# Altium schematic sheet [09] - TK2560_MotorDriver.SchDoc
size A4; SheetNumber: 10; SheetTotal: 15
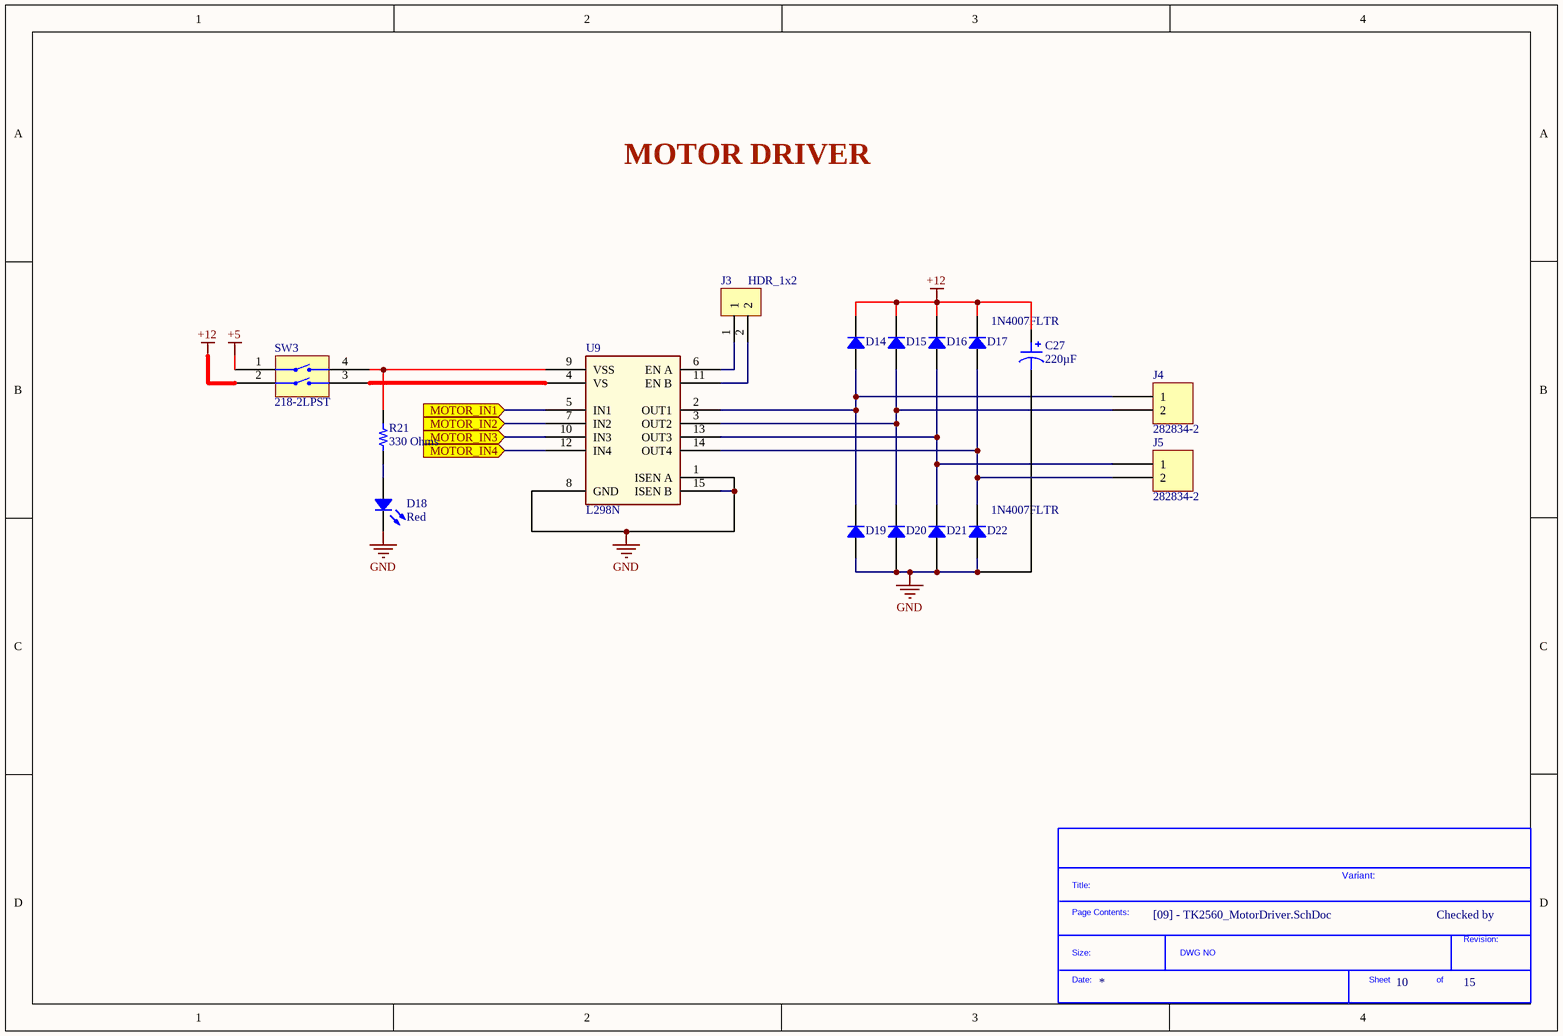
[diagram p0: [09] - TK2560_MotorDriver.SchDoc]

## Parts
*?  SDTitleBlock  (value not drawn)  (graphical)
C27  220µF  [CAP ALSMD 8.3MM H10.5MM]
D14  1N4007FLTR  [SOD123F]  (value not drawn)
D15  1N4007FLTR  [SOD123F]  (value not drawn)
D16  1N4007FLTR  [SOD123F]  (value not drawn)
D17  1N4007FLTR  [SOD123F]
D18  Red  [LED 1206_3216 RED]
D19  1N4007FLTR  [SOD123F]  (value not drawn)
D20  1N4007FLTR  [SOD123F]  (value not drawn)
D21  1N4007FLTR  [SOD123F]  (value not drawn)
D22  1N4007FLTR  [SOD123F]
J3  HDR_1x2  [HDR_1x2]
J4  282834-2  [TE 282834-2]
J5  282834-2  [TE 282834-2]
R21  330 Ohms  [RES 0805_2012]
SW3  218-2LPST  [CTS 218-2LPJ]
U9  L298N  [Multiwatt15]

## Ports
MOTOR_IN1 (in), MOTOR_IN2 (in), MOTOR_IN3 (in), MOTOR_IN4 (in)

## Nets
+5: SW3.1(GND)
+12: C27.1 D14.2 D15.2 D16.2 D17.2 SW3.2(GND)
GND: C27.2 D18.2 D19.1 D20.1 D21.1 D22.1 U9.1(ISEN_A) U9.8(GND) U9.15(ISEN_B)
MOTOR_IN1: U9.5(IN1) ; port MOTOR_IN1
MOTOR_IN2: U9.7(IN2) ; port MOTOR_IN2
MOTOR_IN3: U9.10(IN3) ; port MOTOR_IN3
MOTOR_IN4: U9.12(IN4) ; port MOTOR_IN4
NetD14_1: D14.1 D19.2 J4.1 U9.2(OUT1)
NetD15_1: D15.1 D20.2 J4.2 U9.3(OUT2)
NetD16_1: D16.1 D21.2 J5.1 U9.13(OUT3)
NetD17_1: D17.1 D22.2 J5.2 U9.14(OUT4)
NetD18_1: D18.1 R21.1
NetJ3_1: J3.1 U9.6(EN_A)
NetJ3_2: J3.2 U9.11(EN_B)
NetR21_2: R21.2 SW3.4(GND) U9.9(VSS)
NetSW3_3: SW3.3(GND) U9.4(VS)

## Notes on the sheet
- MOTOR DRIVER
- Variant:
- Checked by
- (in symbol SDTitleBlock) Title:; Page Contents:; Revision:; Size:; DWG NO; Date:; Sheet; of

## Library data of the parts
C27 = EEE-FK1V221GP: CAP ALUM 220UF 20% 35V SMD; Manufacturer: Panasonic Electronic Components; Impedance: 160 mOhms; Lifetime @ Temp.: 5000 Hrs @ 105°C; Polarization: Polar; Ripple Current @ High Frequency: 600mA @ 100kHz; Ripple Current @ Low Frequency: 450mA @ 120Hz; Surface Mount Land Size: 0.327" L x 0.327" W (8.30mm x 8.30mm); Part Number: EEE-FK1V221GP; Applications: Automotive; Capacitance: 220µF; ComponentLink1Description: Datasheet; ComponentLink1URL: http://industrial.panasonic.com/www-cgi/jvcr13pz.cgi?E+PZ+4+ABA0120+EEEFK1V221GP+8+WW; ComponentLink2Description: DigiKey Link; ComponentLink2URL: http://digikey.com/product-detail/en/panasonic-electronic-components/EEE-FK1V221GP/PCE4321CT-ND/1014320; Device Package: Radial, Can - SMD; Height - Seated (Max): 0.413" (10.50mm); LastUpdated: 9/2/2020 01:25:16; Lifecycle Status: Active; Minimum Order: 1; Mounting Type: Surface Mount; Operating Temperature: -55°C ~ 105°C; Package / Case: Radial, Can - SMD; Packaging: TapeAndReel; PartId: 7494; Part Status: Active; Price: 0.33; Ratings: AEC-Q200; Series: FK; Size / Dimension: 0.315" Dia (8.00mm); Supplier 1: DigiKey; Supplier Part Number 1: PCE4321CT-ND; Tolerance: ±20%; Value: 220µF; Voltage - Rated: 35V
D14-D17 D19-D22 = 1N4007FLTR: STANDARD RECTIFIER 1000V SOD-123; Manufacturer: SMC Diode Solutions; Capacitance @ Vr, F: 15pF @ 4V, 1MHz; Current - Average Rectified (Io): 1A; Current - Reverse Leakage @ Vr: 5µA @ 1000V; Speed: Standard Recovery >500ns, > 200mA (Io); Voltage - Forward (Vf) (Max) @ If: 1.1V @ 1A; Part Number: 1N4007FLTR; ComponentLink1Description: Datasheet; ComponentLink1URL: http://www.smc-diodes.com/propdf/1N4001FL-1N4007FL%20N1646%20REV.A.pdf; ComponentLink2Description: DigiKey Link; ComponentLink2URL: http://digikey.com/product-detail/en/smc-diode-solutions/1N4007FLTR/1655-1N4007FLCT-ND/11657827; Diode Type: Standard; LastUpdated: 8/30/2020 20:59:55; Lifecycle Status: Active; Minimum Order: 1; Mounting Type: Surface Mount; Package / Case: SOD-123F; Packaging: TapeAndReel; PartId: 3314; Price: 0.01; Supplier 1: DigiKey; Supplier Part Number 1: 1655-1N4007FLCT-ND; Supplier Device Package: SOD-123FL; Voltage - DC Reverse (Vr) (Max): 1000V
D18 = APTL3216SURCK-01: LED SMD; Manufacturer: Kingbright; Configuration: 1206; Current - Test: 20mA; Lens Color: Colorless; Lens Size: 1.10mm Dia; Lens Style: Round with Domed Top; Lens Transparency: Clear; Millicandela Rating: 230mcd; Viewing Angle: 80°; Voltage - Forward (Vf) (Typ): 1.95V; Wavelength - Dominant: 630nm; Wavelength - Peak: 645nm; Part Number: APTL3216SURCK-01; Color: Red; ComponentLink1Description: Datasheet; ComponentLink1URL: http://www.kingbrightusa.com/images/catalog/SPEC/APTL3216SURCK-01.pdf; ComponentLink2Description: DigiKey Link; ComponentLink2URL: http://digikey.com/product-detail/en/kingbright/APTL3216SURCK-01/754-APTL3216SURCK-01CT-ND/10293135; Device Package: 1206 (3216 Metric); Height (Max): 1.20mm; LastUpdated: 9/2/2020 01:21:09; Lifecycle Status: Active; Minimum Order: 1; Mounting Type: Surface Mount; Package / Case: 1206 (3216 Metric); Packaging: TapeAndReel; PartId: 229; Part Status: Active; Price: 0.08; Series: Heli-R; Size / Dimension: 3.20mm L x 1.60mm W; Supplier 1: DigiKey; Supplier Part Number 1: 754-APTL3216SURCK-01CT-ND; Supplier Device Package: 1206; Value: Red
J3 = HDR_1x2: Pin Header 2.54MM Pitch Str, 1X2PIN, Full G/f, NY6T, 6.1MM*2.5MM*3.0MM / Bag; Manufacturer: Amphenol; Manufacturer Part Number: G800W306018EU; Supplier 1: Mouser; Stock 1: 1088; Pricing 1: 1=0.10000, 10=0.02700, 50=0.02700, 100=0.02600, 1000=0.02200, 10000=0.01900 (USD); RoHS Compliant: Yes; Supplier Part Number 1: 523-G800W306018EU
J4 J5 = 282834-2: TERM BLK 2P SIDE ENT 2.54MM PCB; Manufacturer: TE Connectivity AMP Connectors; Current: 10A; Mating Orientation: Horizontal with Board; Number of Levels: 1; Pitch: 0.100" (2.54mm); Positions Per Level: 2; Voltage: 150V; Wire Gauge: 16-30 AWG; Wire Termination: Screw - Rising Cage Clamp; Part Number: 282834-2; Color: Green; ComponentLink1Description: Datasheet; ComponentLink1URL: https://www.te.com/commerce/DocumentDelivery/DDEController?Action=srchrtrv&DocNm=282834&DocType=Customer+Drawing&DocLang=English; ComponentLink2Description: DigiKey Link; ComponentLink2URL: http://digikey.com/product-detail/en/te-connectivity-amp-connectors/282834-2/A98333-ND/1150135; LastUpdated: 1/15/2020 04:15:38; Lifecycle Status: Active; Minimum Order: 1; Mounting Type: Through Hole; Packaging: Bulk; Part Status: Active; Price: 0.88; Series: Buchanan; Supplier 1: DigiKey; Supplier Part Number 1: A98333-ND
R21 = ERJ-6GEYJ331V: RES SMD 330 OHM 5% 1/8W 0805; Manufacturer: Panasonic Electronic Components; Power (Watts): 0.125W, 1/8W; Temperature Coefficient: ±200ppm/°C; Part Number: ERJ-6GEYJ331V; Value: 330 Ohms; ComponentLink1Description: Datasheet; ComponentLink1URL: http://industrial.panasonic.com/www-cgi/jvcr13pz.cgi?E+PZ+3+AOA0001+ERJ6GEYJ331V+7+WW; ComponentLink2Description: DigiKey Link; ComponentLink2URL: http://digikey.com/product-detail/en/panasonic-electronic-components/ERJ-6GEYJ331V/P330ACT-ND/90025; Composition: Thick Film; Device Package: 0805 (2012 Metric); Features: Automotive AEC-Q200; Height - Seated (Max): 0.028" (0.70mm); LastUpdated: 02/09/2020 01:15:19; Lifecycle Status: Active; Minimum Order: 1; Number of Terminations: 2; Operating Temperature: -55°C ~ 155°C; Package / Case: 0805 (2012 Metric); Packaging: TapeAndReel; PartId: 30017; Part Status: Active; Price: 0.01; Ratings: AEC-Q200; Resistance: 330 Ohms; Series: ERJ; Size / Dimension: 0.079" L x 0.049" W (2.00mm x 1.25mm); Supplier 1: DigiKey; Supplier Part Number 1: P330ACT-ND; Supplier Device Package: 0805; Tolerance: ±5%
SW3 = 218-2LPST: SWITCH SLIDE DIP SPST 25MA 24V; Manufacturer: CTS Electrocomponents; Actuator Level: Flush, Recessed; Actuator Type: Slide (Standard); Number of Positions: 2; Pitch: 0.050" (1.27mm), Half; Voltage Rating: 24VDC; Washable: Yes; Part Number: 218-2LPST; Circuit: SPST; ComponentLink1Description: Datasheet; ComponentLink1URL: https://www.ctscorp.com/wp-content/uploads/218.pdf; ComponentLink2Description: DigiKey Link; ComponentLink2URL: http://digikey.com/product-detail/en/cts-electrocomponents/218-2LPST/CT2182LPST-ND/267319; Contact Finish: Gold; Contact Material: Beryllium Copper; Current Rating (Amps): 25mA; Features: Epoxy Sealed Terminals, Tape Seal; Height Above Board: 0.104" (2.65mm); LastUpdated: 1/4/2020 18:30:26; Lifecycle Status: Active; Minimum Order: 1; Mounting Type: Surface Mount; Operating Temperature: -55°C ~ 85°C; Packaging: Tube; PartId: 3; Part Status: Active; Price: 1.04; Series: 218; Supplier 1: DigiKey; Supplier Part Number 1: CT2182LPST-ND; Termination Style: Gull Wing
U9 = L298N: Motor / Motion / Ignition Controllers & Drivers Dual Full Bridge; Manufacturer: STMicroelectronics; Number of Outputs: 4; Output Current: 2A; Output Voltage: 46V; Operating Supply Voltage: 42V; Min Supply Voltage: 4.8V; Max Output Current: 3A; Operating Supply Current: 13mA; Quiescent Current: 500mA; Number of Drivers: 2; Motor Type: Brushed; Output Impedance: 24mR; Manufacturer Part Number: L298N; RoHS: Yes; Category: Motor Drivers; Stock 1: 13112; Pricing 1: 1=5.15000, 10=4.62700, 25=4.37400, 100=3.59650, 250=3.22712, 500=3.11046, 1000=2.58557, 2500=2.48837, 5000=2.47590 (USD); Mount: Through Hole; Number of Pins: 15; Min Operating Temperature: -25°C; Max Operating Temperature: 130°C; Packaging: Rail/Tube; Max Supply Voltage: 46V; Package Quantity: 25; Output Current per Channel: 2A; Max Collector Current: 3A; Collector Emitter Voltage (VCEO): 46V; Series: -; Length: 19.6mm; Width: 5mm; Height: 10.7mm; Radiation Hardening: No; REACH SVHC: No SVHC; Lead Free: Lead Free; RoHS Compliant: Yes; ComponentLink1URL: https://datasheet.ciiva.com/15109/getdatasheetpartid-50682-15109332.pdf?src-supplier=Verical; ComponentLink1Description: https://datasheet.ciiva.com/15109/getdatasheetpartid-50682-15109332.pdf?src-supplier=Verical; ComponentLink2URL: https://datasheet.ciiva.com/19456/245403-19456698.pdf?src-supplier=Jameco; ComponentLink2Description: https://datasheet.ciiva.com/19456/245403-19456698.pdf?src-supplier=Jameco; ComponentLink3URL: https://datasheet.ciiva.com/25626/0900766b80060c26-25626619.pdf?src-supplier=RSComponents; ComponentLink3Description: https://datasheet.ciiva.com/25626/0900766b80060c26-25626619.pdf?src-supplier=RSComponents; ComponentLink4URL: https://datasheet.ciiva.com/14150/ofl298n-647108-dat-en-14150301.pdf?src-supplier=Distrelec; ComponentLink4Description: https://datasheet.ciiva.com/14150/ofl298n-647108-dat-en-14150301.pdf?src-supplier=Distrelec; ComponentLink5URL: https://datasheet.ciiva.com/29306/156128-da-01-en-dual-bridge-driv-l298n-29306997.pdf?src-supplier=Conrad; ComponentLink5Description: https://datasheet.ciiva.com/29306/156128-da-01-en-dual-bridge-driv-l298n-29306997.pdf?src-supplier=Conrad; ComponentLink6URL: https://datasheet.ciiva.com/26880/l298n-26880153.pdf?src-supplier=IIIC; ComponentLink6Description: https://datasheet.ciiva.com/26880/l298n-26880153.pdf?src-supplier=IIIC; ComponentLink7URL: https://datasheet.ciiva.com/1608/1693054-1608165.pdf?src-supplier=Newark; ComponentLink7Description: https://datasheet.ciiva.com/1608/1693054-1608165.pdf?src-supplier=Newark; ComponentLink8URL: https://datasheet.ciiva.com/1500/1693054-1500714.pdf?src-supplier=Element14; ComponentLink8Description: https://datasheet.ciiva.com/1500/1693054-1500714.pdf?src-supplier=Element14; ComponentLink9URL: https://datasheet.ciiva.com/1501/1693054-1501547.pdf?src-supplier=Element14; ComponentLink9Description: https://datasheet.ciiva.com/1501/1693054-1501547.pdf?src-supplier=Element14; ComponentLink10URL: https://datasheet.ciiva.com/1955/cd00000240-1955436.pdf?src-supplier=Digi-Key; ComponentLink10Description: https://datasheet.ciiva.com/1955/cd00000240-1955436.pdf?src-supplier=Digi-Key; ComponentLink11URL: https://datasheet.ciiva.com/4895/cd00000240-4895919.pdf?src-supplier=Mouser; ComponentLink11Description: https://datasheet.ciiva.com/4895/cd00000240-4895919.pdf?src-supplier=Mouser; Supplier 1: Digi-Key; Supplier Part Number 1: 497-1395-5-ND